# EAGLE design swichboard (EAGLE 6.4)
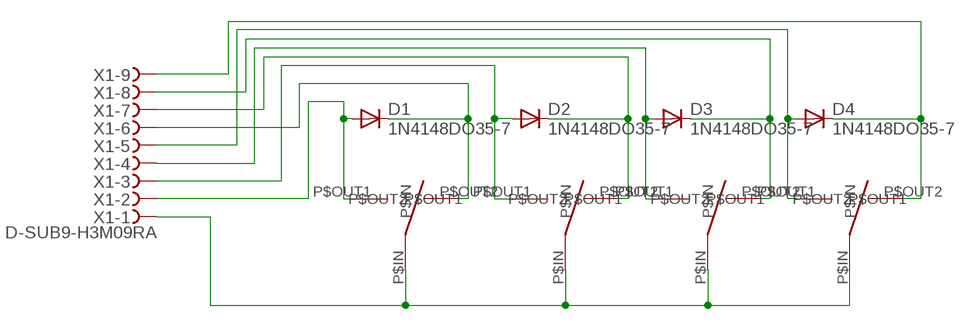
[diagram p0: schematic, sheet 1]

## Parts
D1  1N4148DO35-7  [DO35-7]
D2  1N4148DO35-7  [DO35-7]
D3  1N4148DO35-7  [DO35-7]
D4  1N4148DO35-7  [DO35-7]
U$1  MS500E  [MS500E]
U$2  MS500E  [MS500E]
U$3  MS500E  [MS500E]
U$4  MS500E  [MS500E]
X1  D-SUB9-H3M09RA  [H3M09RA]

## Nets
N$2: D1.A U$1.P$OUT1 X1.2
N$3: D1.C U$1.P$OUT2 X1.6
N$4: D2.A U$2.P$OUT1 X1.3
N$5: D2.C U$2.P$OUT2 X1.7
N$6: D3.A U$3.P$OUT1 X1.4
N$7: D3.C U$3.P$OUT2 X1.8
N$8: D4.A U$4.P$OUT1 X1.5
N$9: D4.C U$4.P$OUT2 X1.9
VCC: U$1.P$IN U$2.P$IN U$3.P$IN U$4.P$IN X1.1

## Library data of the parts
D1-D4 = diode:1N4148: DIODE high speed (Philips)
U$1-U$4 = n39:MS500E: MS 500E :: Kippschalter 1-polig, 6A-125VAC, (Ein)-Aus-(Ein) http://www.reichelt.de/index.html?ARTICLE=13158
X1 = con-thomas-betts:D-SUB9-: D-Subminiatur Connector Source: Electronioc Interconnects European Edition 1998; OC_FARNELL: unknown; OC_NEWARK: unknown

## Board
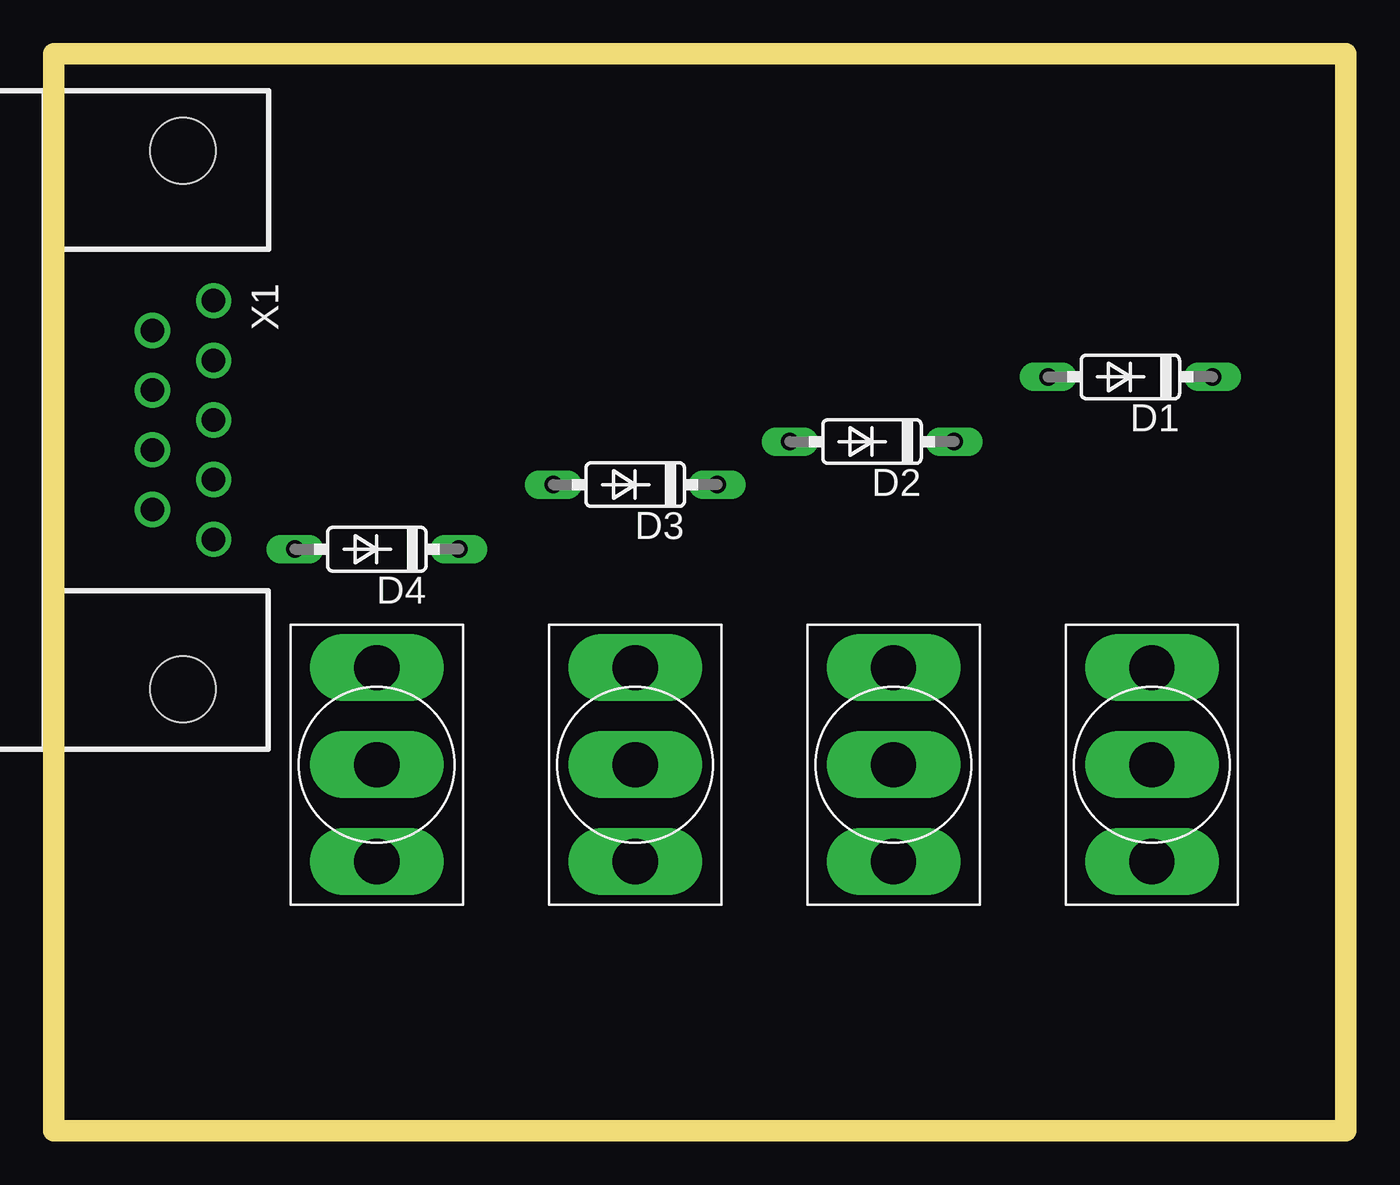
[diagram p1: board, top side]
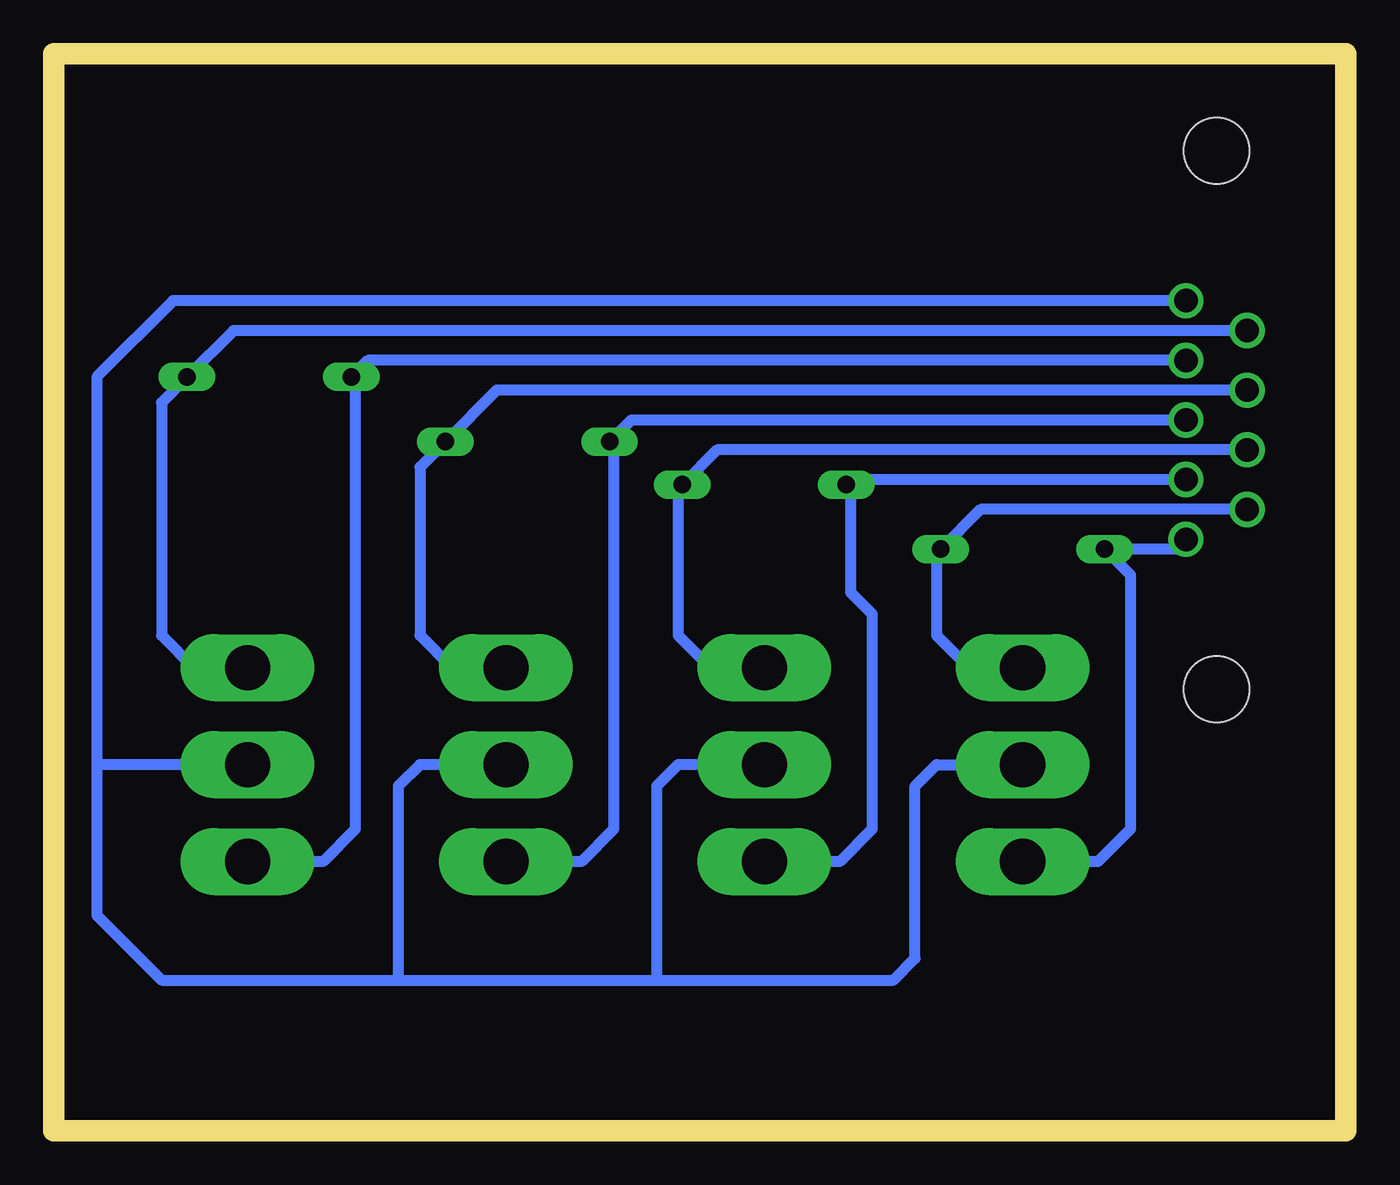
[diagram p2: board, bottom side, seen from below]

Size 60 x 50 mm. Coordinates in mm from the lower left corner, seen from the top.
Outline: 0,0 60,0 60,50 0,50 0,0
Copper layers (1*16): Top 0.035mm / dielectric 1.5mm / Bottom 0.035mm
Design rules "default": minimum track width 10mil, minimum drill 24mil, track to track 8mil, track to pad 8mil, pad to pad 8mil, via to via 8mil, smd to smd 8mil, copper to edge 40mil, drill to drill 8mil, minimum pad ring 10mil, minimum via ring 8mil, stop-mask expansion 4mil, vias tented up to drill 0mil, thermal gap 10mil

### Footprints (pad centres in the part's own frame; a part is rotated, then mirrored left to right if it is on the bottom)
DO35-7 = drill 0.813 long: A 3.81,0; C -3.81,0
MS500E = drill 2.1 long: P$IN 0,0; P$OUT1 0,4.5; P$OUT2 0,-4.5
H3M09RA = drill 1.092: 1 -5.537,1.422; 2 -2.769,1.422; 3 0,1.422; 4 2.769,1.422; 5 5.537,1.422; 6 -4.153,-1.422; 7 -1.384,-1.422; 8 1.384,-1.422; 9 4.153,-1.422 | hole 3.048: -12.497,0; 12.497,0

### Placement (x,y rotation side)
D1  50,35 180 top
D2  38,32 180 top
D3  27,30 180 top
D4  15,27 180 top
U$1  51,17 180 top
U$2  39,17 180 top
U$3  27,17 180 top
U$4  15,17 180 top
X1  6,33 270 top

### Tracks (layer width: path | path; a pad name or v marks a point on that pad's centre or on a via)
N$2
  Bottom 0.5: U$1.P$OUT1 47.5,12.5 46,14 46,34.81 D1.A 45.42,35.77 X1.2
N$3
  Bottom 0.5: U$1.P$OUT2 53.5,21.5 55,23 55,33.81 D1.C 51.66,37.15 X1.6
N$4
  Bottom 0.5: U$2.P$OUT1 35.5,12.5 34,14 34,31.81 D2.A 33.19,33 X1.3
N$5
  Bottom 0.5: U$2.P$OUT2 41.5,21.5 43,23 43,30.81 D2.C 39.43,34.38 X1.7
N$6
  Bottom 0.5: U$3.P$OUT1 23.5,12.5 22,14 22,24 23,25 23,29.81 D3.A 22.96,30.23 X1.4
N$7
  Bottom 0.5: U$3.P$OUT2 29.5,21.5 31,23 31,29.81 D3.C 29.19,31.62 X1.8
N$8
  Bottom 0.5: U$4.P$OUT1 11.5,12.5 10,14 10,25.81 D4.A 7.88,27 X1.5
N$9
  Bottom 0.5: U$4.P$OUT2 17.5,21.5 19,23 19,26.81 D4.C 16.96,28.85 X1.9
VCC
  Bottom 0.5: X1.1 54.46,38.54 58,35 58,17 | 58,17 58,10 55,7 44,7 | 44,7 32,7 | 32,7 21,7 20,8 20,16 19,17 U$4.P$IN | U$3.P$IN 31,17 32,16 32,7 | U$2.P$IN 43,17 44,16 44,7 | U$1.P$IN 58,17